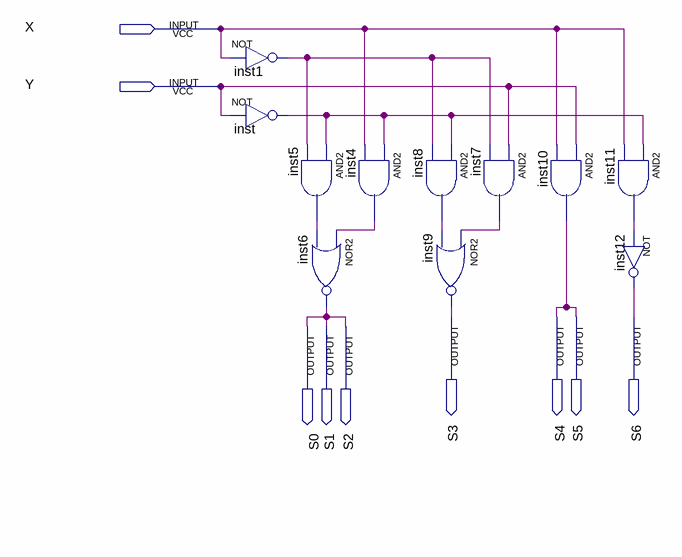
[diagram p0: schematic sheet]
// Quartus schematic circuito_base.bdf as structural Verilog: 11 symbols, 9 pins
module circuito_base (
  input  X,
  input  Y,
  output S3,
  output S4,
  output S5,
  output S6,
  output S0,
  output S1,
  output S2
);

  wire inst1_out, inst4_out, inst5_out, inst7_out, inst8_out, inst11_out, inst_out;

  not inst1 (inst1_out, X);
  not inst (inst_out, Y);
  and inst5 (inst5_out, inst_out, inst1_out);
  nor inst6 (S0, inst4_out, inst5_out);
  and inst4 (inst4_out, inst_out, X);
  and inst8 (inst8_out, inst_out, inst1_out);
  nor inst9 (S3, inst7_out, inst8_out);
  and inst7 (inst7_out, Y, inst1_out);
  and inst10 (S4, Y, X);
  and inst11 (inst11_out, inst_out, X);
  not inst12 (S6, inst11_out);

  assign S1 = S0;
  assign S2 = S0;
  assign S5 = S4;
endmodule
